# EAGLE design mag_encoder_Rev1 (EAGLE 7.3.0)
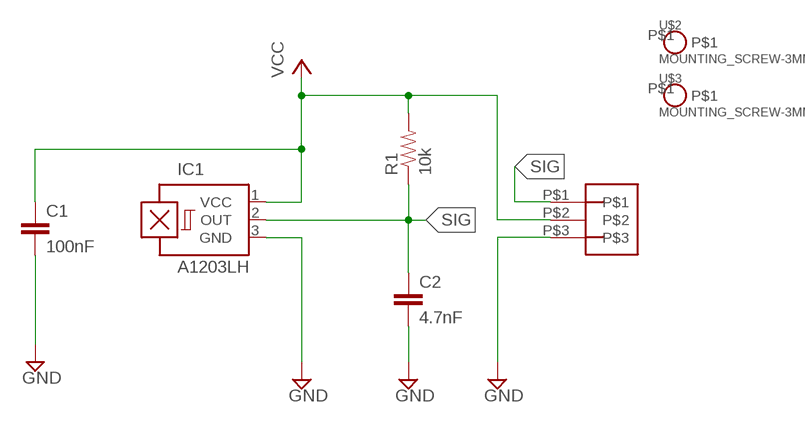
[diagram p0: schematic, sheet 1]

## Parts
C1  100nF  CAP0603-CAP  [0603-CAP]
C2  4.7nF  4.7NF-50V-10%(0603)  [0603-CAP]
IC1  A1203LH  [SOT23-W]
R1  10k  10.5KOHM1/10W1%(0603)  [0603]
U$1  3_PIN_JST-XH  [3_PIN_JST-XH]
U$2  MOUNTING_SCREW-3MM  [MOUNTING_SCREW-3MM]
U$3  MOUNTING_SCREW-3MM  [MOUNTING_SCREW-3MM]

## Nets
GND: C1.2 C2.2 IC1.3(GND) U$1.P$3
SIG: C2.1 IC1.2(OUT) R1.1 U$1.P$1
VCC: C1.1 IC1.1(VCC) R1.2 U$1.P$2
Unconnected: U$2.P$1 U$3.P$1

## Library data of the parts
C1 = SparkFun-Capacitors:CAP: Capacitor Standard 0603 ceramic capacitor, and 0.1" leaded capacitor.
C2 = SparkFun-Capacitors:4.7NF-50V-10%(0603): CAP-11378; PROD_ID: CAP-11378
IC1 = allegro:A12*?: Hall-effect bipolar switch Source: http://www.allegromicro.com/en/Products/Part_Numbers/1202/1202.pdf; MF: ALLEGRO MICROSYSTEMS, INC.; MPN: A1203LLHLT-T; OC_FARNELL: 1791384; OC_NEWARK: 31K6608
R1 = SparkFun-Resistors:10.5KOHM1/10W1%(0603): RES-09570; PROD_ID: RES-09570; VALUE: 10.5k
U$1 = Clayton:3_PIN_JST-XH: 3-pin JST XH Shrouded Header, top entry, 2.5 mm pitch
U$2 U$3 = Clayton:MOUNTING_SCREW-3MM

## Board
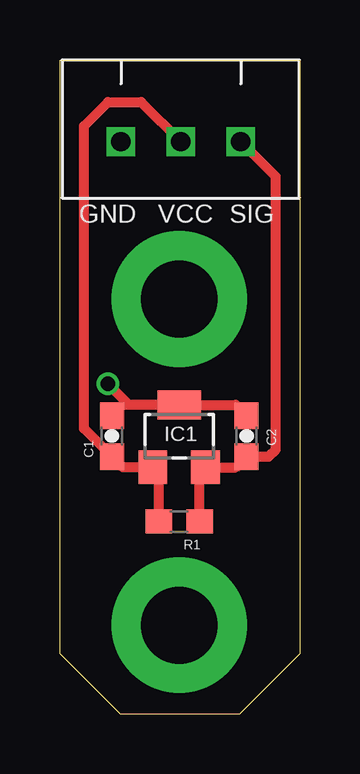
[diagram p1: board, top side]
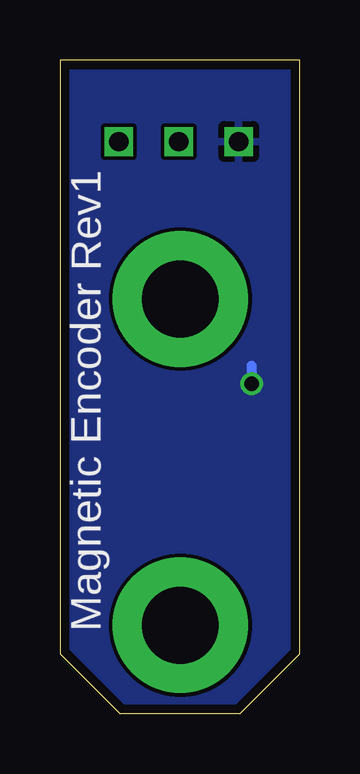
[diagram p2: board, bottom side, seen from below]

Size 10 x 27.25 mm. Coordinates in mm from the lower left corner, seen from the top.
Outline: 2.5,0 7.5,0 10,2.5 10,27.25 0,27.25 0,2.5 2.5,0
Copper layers (1*16): Top 0.0356mm / dielectric 1.5011mm / Bottom 0.0356mm
Design rules "LaenPCBOrder": minimum track width 6mil, minimum drill 13mil, track to track 6mil, track to pad 6mil, pad to pad 6mil, via to via 6mil, smd to smd 6mil, copper to edge 15mil, drill to drill 6mil, minimum pad ring 7mil, minimum via ring 7mil, stop-mask expansion 3mil, vias tented up to drill 0mil, thermal gap 10mil

### Footprints (pad centres in the part's own frame; a part is rotated, then mirrored left to right if it is on the bottom)
0603-CAP = smd 1.1 x 1: 1 -0.85,0; 2 0.85,0
SOT23-W = smd 1.2 x 1.4: 1 -1.1,-1.3; 2 1.1,-1.3 | smd 1.8 x 1.2: 3 0,1.3
0603 = smd 1.1 x 1: 1 -0.85,0; 2 0.85,0
3_PIN_JST-XH = drill 0.8 square: P$1 2.45,3.4; P$2 4.95,3.4; P$3 7.45,3.4
MOUNTING_SCREW-3MM = drill 3.2 pad 5.65: P$1 0,0

### Placement (x,y rotation side)
C1  2.17,11.56 90 top
C2  7.79,11.56 90 top
IC1  4.98,11.56 0 top
R1  4.98,8 180 top
U$1  9.99,27.25 180 top
U$2  4.98,3.68 0 top
U$3  4.98,17.28 0 top

### Tracks (layer width: path | path; a pad name or v marks a point on that pad's centre or on a via)
GND  (via drill 0.6)
  Top 0.254: 5.26,12.53 5.03,12.76 IC1.3
  Top 0.406: IC1.3 7.34,12.87 C2.2 | IC1.3 2.62,12.87 C1.2 | IC1.3 2.88,12.87 v2,13.75
  Bottom 0.406: v2,13.75 2,14.5
  pour Bottom: -0.64,-0.01 24,0.12 24.64,32 -0.64,32.13
SIG
  Top 0.406: R1.1 5.83,10.02 IC1.2 7.34,10.27 C2.1 8.71,10.71 9,11 9,22.39 U$1.P$1
VCC
  Top 0.152: 3.99,10.17 IC1.1
  Top 0.406: R1.2 4.13,10.02 IC1.1 2.62,10.27 C1.1 1,11.88 1,24.5 2,25.5 3.39,25.5 U$1.P$2

### Text on the board
tNames: GND | VCC | SIG
bNames: Magnetic Encoder Rev1